# EAGLE design mcu_teensy3.6 (EAGLE 9.5.2)
c't-Bot v2 MCU Board; CC BY-SA 4.0, Timo Sandmann
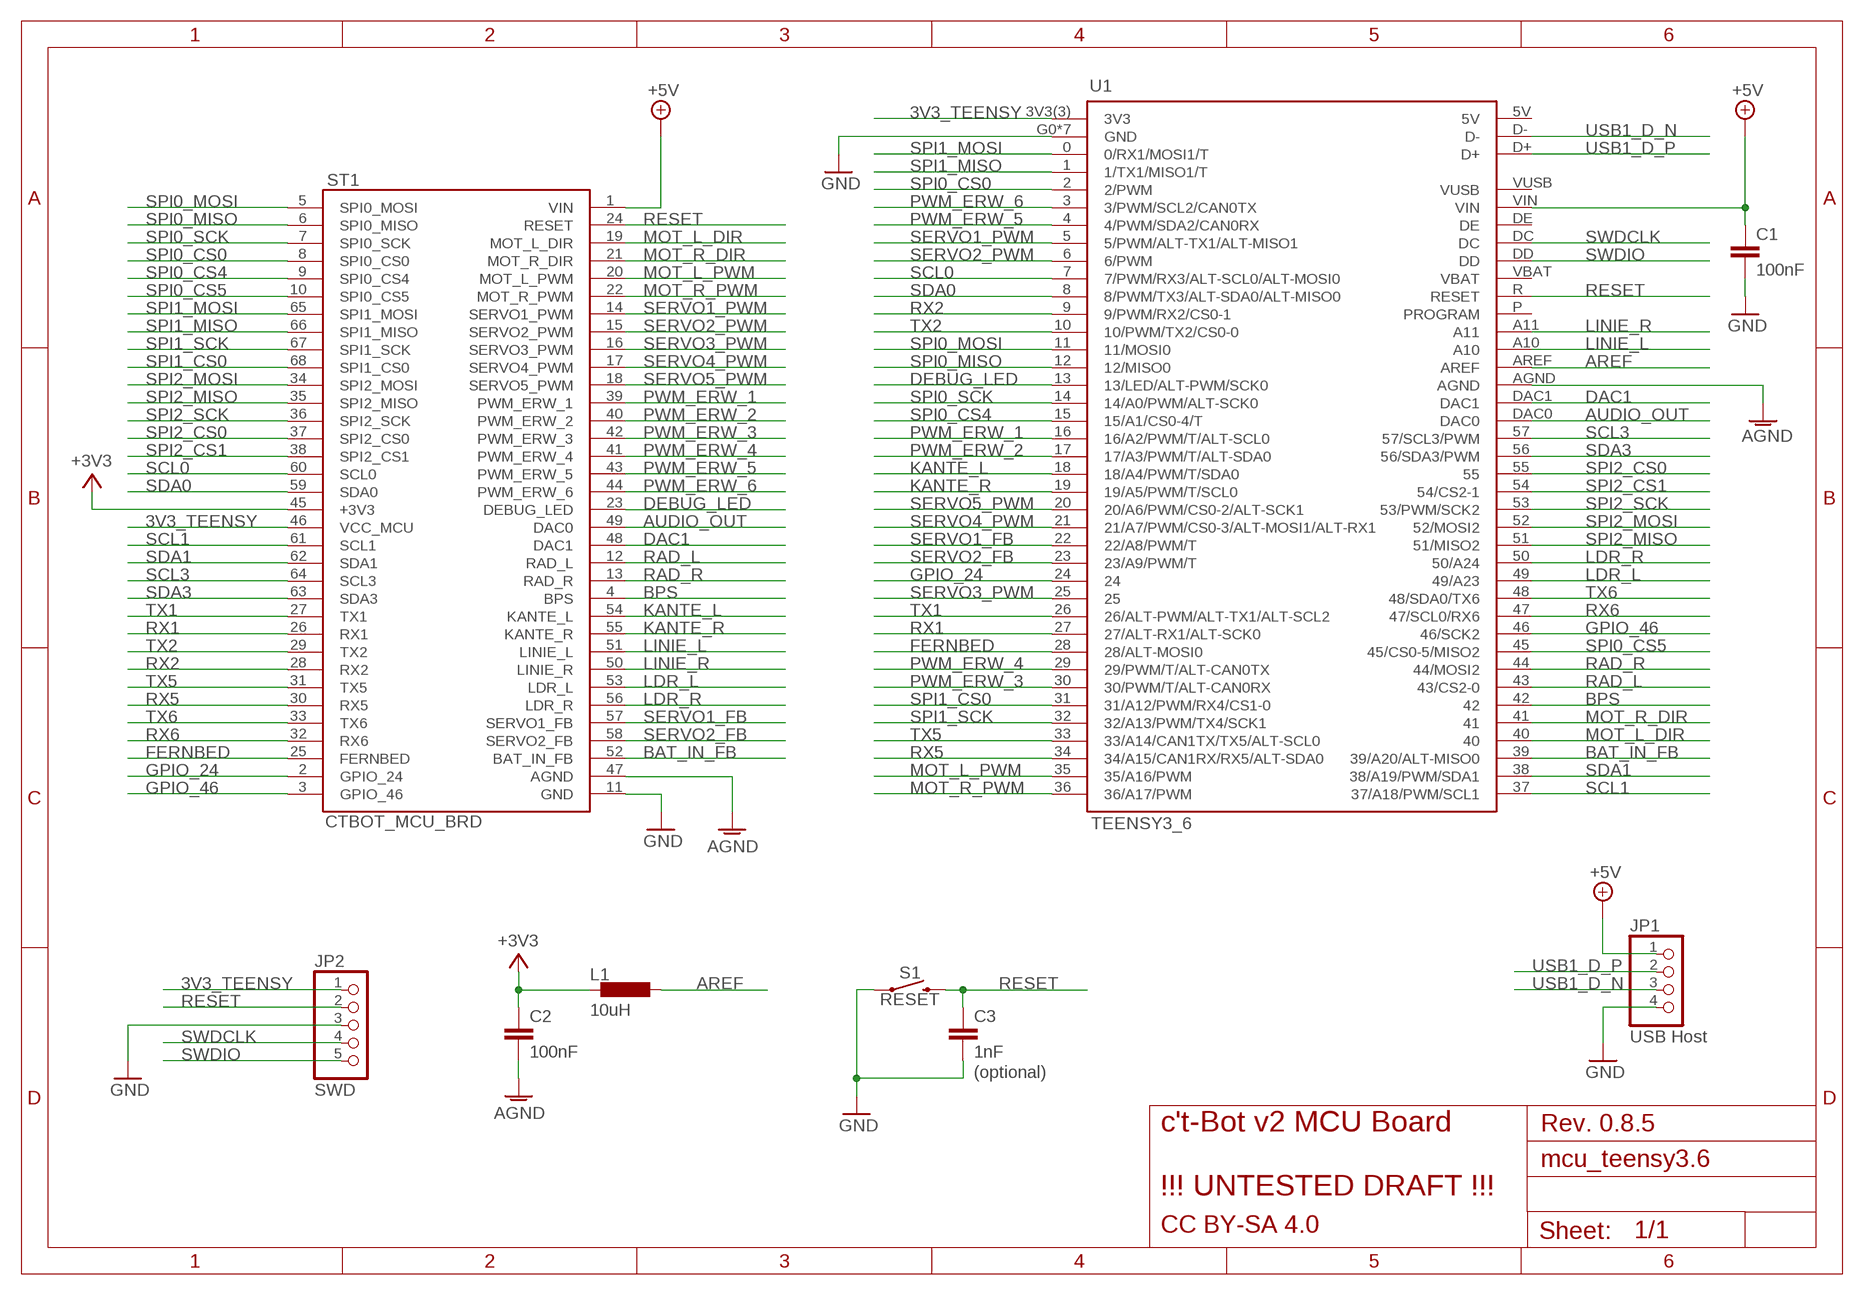
[diagram p0: schematic, sheet 1]

## Parts
C1  100nF  C-EU025-025X050  [C025-025X050]
C2  100nF  C-EU025-025X050  [C025-025X050]
C3  1nF  C-EU025-025X050  [C025-025X050]
JP1  USB Host  PINHD-1X4/90  [1X04/90]
JP2  SWD  PINHD-1X5/90  [1X05/90]
L1  10uH  L-EU0207/10  [0207/10]
S1  RESET  MOMENTARY-SWITCH-SPST-PTH-6.0MM  [TACTILE_SWITCH_PTH_6.0MM]
ST1  CTBOT_MCU_BRD  [DIP66]
U1  TEENSY3_6  [T36]

## Nets
3V3_TEENSY: JP2.1 ST1.46(VCC_MCU) U1.3V3(3)(3V3)
+3V3: C2.1 L1.2 ST1.45(+3V3)
+5V: C1.1 JP1.1 ST1.1(VIN) U1.VIN
AGND: C2.2 ST1.47(AGND) U1.AGND
AREF: L1.1 U1.AREF
AUDIO_OUT: ST1.49(DAC0) U1.DAC0
BAT_IN_FB: ST1.52(BAT_IN_FB) U1.39(39/A20/ALT-MISO0)
BPS: ST1.4(BPS) U1.42
DAC1: ST1.48(DAC1) U1.DAC1
DEBUG_LED: ST1.23(DEBUG_LED) U1.13(13/LED/ALT-PWM/SCK0)
FERNBED: ST1.25(FERNBED) U1.28(28/ALT-MOSI0)
GND: C1.2 C3.2 JP1.4 JP2.3 S1.1 ST1.11(GND) U1.G0(GND) U1.G1(GND) U1.G2(GND) U1.G3(GND) U1.G4(GND) U1.G5(GND) U1.G6(GND)
GPIO_24: ST1.2(GPIO_24) U1.24
GPIO_46: ST1.3(GPIO_46) U1.46(46/SCK2)
KANTE_L: ST1.54(KANTE_L) U1.18(18/A4/PWM/T/SDA0)
KANTE_R: ST1.55(KANTE_R) U1.19(19/A5/PWM/T/SCL0)
LDR_L: ST1.53(LDR_L) U1.49(49/A23)
LDR_R: ST1.56(LDR_R) U1.50(50/A24)
LINIE_L: ST1.51(LINIE_L) U1.A10
LINIE_R: ST1.50(LINIE_R) U1.A11
MOT_L_DIR: ST1.19(MOT_L_DIR) U1.40
MOT_L_PWM: ST1.20(MOT_L_PWM) U1.35(35/A16/PWM)
MOT_R_DIR: ST1.21(MOT_R_DIR) U1.41
MOT_R_PWM: ST1.22(MOT_R_PWM) U1.36(36/A17/PWM)
PWM_ERW_1: ST1.39(PWM_ERW_1) U1.16(16/A2/PWM/T/ALT-SCL0)
PWM_ERW_2: ST1.40(PWM_ERW_2) U1.17(17/A3/PWM/T/ALT-SDA0)
PWM_ERW_3: ST1.42(PWM_ERW_3) U1.30(30/PWM/T/ALT-CAN0RX)
PWM_ERW_4: ST1.41(PWM_ERW_4) U1.29(29/PWM/T/ALT-CAN0TX)
PWM_ERW_5: ST1.43(PWM_ERW_5) U1.4(4/PWM/SDA2/CAN0RX)
PWM_ERW_6: ST1.44(PWM_ERW_6) U1.3(3/PWM/SCL2/CAN0TX)
RAD_L: ST1.12(RAD_L) U1.43(43/CS2-0)
RAD_R: ST1.13(RAD_R) U1.44(44/MOSI2)
RESET: C3.1 JP2.2 S1.3 ST1.24(RESET) U1.R(RESET)
RX1: ST1.26(RX1) U1.27(27/ALT-RX1/ALT-SCK0)
RX2: ST1.28(RX2) U1.9(9/PWM/RX2/CS0-1)
RX5: ST1.30(RX5) U1.34(34/A15/CAN1RX/RX5/ALT-SDA0)
RX6: ST1.32(RX6) U1.47(47/SCL0/RX6)
SCL0: ST1.60(SCL0) U1.7(7/PWM/RX3/ALT-SCL0/ALT-MOSI0)
SCL1: ST1.61(SCL1) U1.37(37/A18/PWM/SCL1)
SCL3: ST1.64(SCL3) U1.57(57/SCL3/PWM)
SDA0: ST1.59(SDA0) U1.8(8/PWM/TX3/ALT-SDA0/ALT-MISO0)
SDA1: ST1.62(SDA1) U1.38(38/A19/PWM/SDA1)
SDA3: ST1.63(SDA3) U1.56(56/SDA3/PWM)
SERVO1_FB: ST1.57(SERVO1_FB) U1.22(22/A8/PWM/T)
SERVO1_PWM: ST1.14(SERVO1_PWM) U1.5(5/PWM/ALT-TX1/ALT-MISO1)
SERVO2_FB: ST1.58(SERVO2_FB) U1.23(23/A9/PWM/T)
SERVO2_PWM: ST1.15(SERVO2_PWM) U1.6(6/PWM)
SERVO3_PWM: ST1.16(SERVO3_PWM) U1.25
SERVO4_PWM: ST1.17(SERVO4_PWM) U1.21(21/A7/PWM/CS0-3/ALT-MOSI1/ALT-RX1)
SERVO5_PWM: ST1.18(SERVO5_PWM) U1.20(20/A6/PWM/CS0-2/ALT-SCK1)
SPI0_CS0: ST1.8(SPI0_CS0) U1.2(2/PWM)
SPI0_CS4: ST1.9(SPI0_CS4) U1.15(15/A1/CS0-4/T)
SPI0_CS5: ST1.10(SPI0_CS5) U1.45(45/CS0-5/MISO2)
SPI0_MISO: ST1.6(SPI0_MISO) U1.12(12/MISO0)
SPI0_MOSI: ST1.5(SPI0_MOSI) U1.11(11/MOSI0)
SPI0_SCK: ST1.7(SPI0_SCK) U1.14(14/A0/PWM/ALT-SCK0)
SPI1_CS0: ST1.68(SPI1_CS0) U1.31(31/A12/PWM/RX4/CS1-0)
SPI1_MISO: ST1.66(SPI1_MISO) U1.1(1/TX1/MISO1/T)
SPI1_MOSI: ST1.65(SPI1_MOSI) U1.0(0/RX1/MOSI1/T)
SPI1_SCK: ST1.67(SPI1_SCK) U1.32(32/A13/PWM/TX4/SCK1)
SPI2_CS0: ST1.37(SPI2_CS0) U1.55
SPI2_CS1: ST1.38(SPI2_CS1) U1.54(54/CS2-1)
SPI2_MISO: ST1.35(SPI2_MISO) U1.51(51/MISO2)
SPI2_MOSI: ST1.34(SPI2_MOSI) U1.52(52/MOSI2)
SPI2_SCK: ST1.36(SPI2_SCK) U1.53(53/PWM/SCK2)
SWDCLK: JP2.4 U1.DC
SWDIO: JP2.5 U1.DD
TX1: ST1.27(TX1) U1.26(26/ALT-PWM/ALT-TX1/ALT-SCL2)
TX2: ST1.29(TX2) U1.10(10/PWM/TX2/CS0-0)
TX5: ST1.31(TX5) U1.33(33/A14/CAN1TX/TX5/ALT-SCL0)
TX6: ST1.33(TX6) U1.48(48/SDA0/TX6)
USB1_D_N: JP1.3 U1.D-
USB1_D_P: JP1.2 U1.D+
Unconnected: U1.5V U1.DE U1.P(PROGRAM) U1.VBAT U1.VUSB

## Notes on the sheet
- (optional)
- Rev. 0.8.5
- c't-Bot v2 MCU Board
  
  !!! UNTESTED DRAFT !!!
- CC BY-SA 4.0

## Library data of the parts
C1-C3 = rcl:C-EU: CAPACITOR, European symbol; SPICEPREFIX: C
JP1 = pinhead_ts:PINHD-1X4: PIN HEADER
JP2 = pinhead_ts:PINHD-1X5: PIN HEADER
L1 = rcl:L-EU: INDUCTOR, European symbol; SPICEPREFIX: L
S1 = SparkFun-Switches:MOMENTARY-SWITCH-SPST: Momentary Switch (Pushbutton) - SPST Normally-open (NO) SPST momentary switches (buttons, pushbuttons). Variants PTH-12MM - 12mm square, through-hole Momentary Pushbutton Switch - 12mm Square <https://www.sparkfun.com/products/9190> (COM-09190) PTH-6.0MM, PTH-6.0MM-KIT - 6.0mm square, through-hole Mini Pushbutton Switch <https://www.sparkfun.com/products/97> (COM-00097) KIT package intended for soldering kit's - only one side of pads' copper is exposed. PTH-RIGHT-ANGLE-KIT - Right-angle, through-hole Right Angle Tactile Button <https://www.sparkfun.com/products/10791> - Used on SparkFun BigTime Watch Kit <https://www.sparkfun.com/products/11734> SMD-12MM - 12mm square, surface-mount Tactile Button - SMD (12mm) <https://www.sparkfun.com/products/12993> (COM-12993) Used on SparkFun PicoBoard <https://www.sparkfun.com/products/11888> SMD-4.5MM - 4.5mm Square Trackball Switch Used on SparkFun Blackberry Trackballer Breakout <https://www.sparkfun.com/products/13169> SMD-4.6MMX2.8MM - 4.60mm x 2.80mm, surface mount Used on SparkFun SAMD21 Mini Breakout <https://www.sparkfun.com/products/13664> SMD-5.2MM, SMD-5.2-REDUNDANT - 5.2mm square, surface-mount Mini Pushbutton Switch - SMD <https://www.sparkfun.com/products/8720> (COM-08720) Used on Arduino Pro Mini <https://www.sparkfun.com/products/11114> REDUNDANT package connects both switch circuits together SMD-6.0X3.5MM - 6.0 x 3.5mm, surface mount Momentary Reset Switch SMD <https://www.sparkfun.com/products/8229> (COM-08229) SMD-6.2MM-TALL - 6.2mm square, surface mount Tactile Button - SMD (6mm) <https://www.sparkfun.com/products/12992> Used on SparkFun Digital Sandbox <https://www.sparkfun.com/products/12651> SMD-RIGHT-ANGLE - Right-angle, surface mount Used on SparkFun Block for Intel® Edison - Arduino <https://www.sparkfun.com/products/13036>; PROD_ID: SWCH-08441; SF_SKU: COM-00097
ST1 = ct-bot:CTBOT_MCU_BRD
U1 = ct-bot:TEENSY3_6

## Board
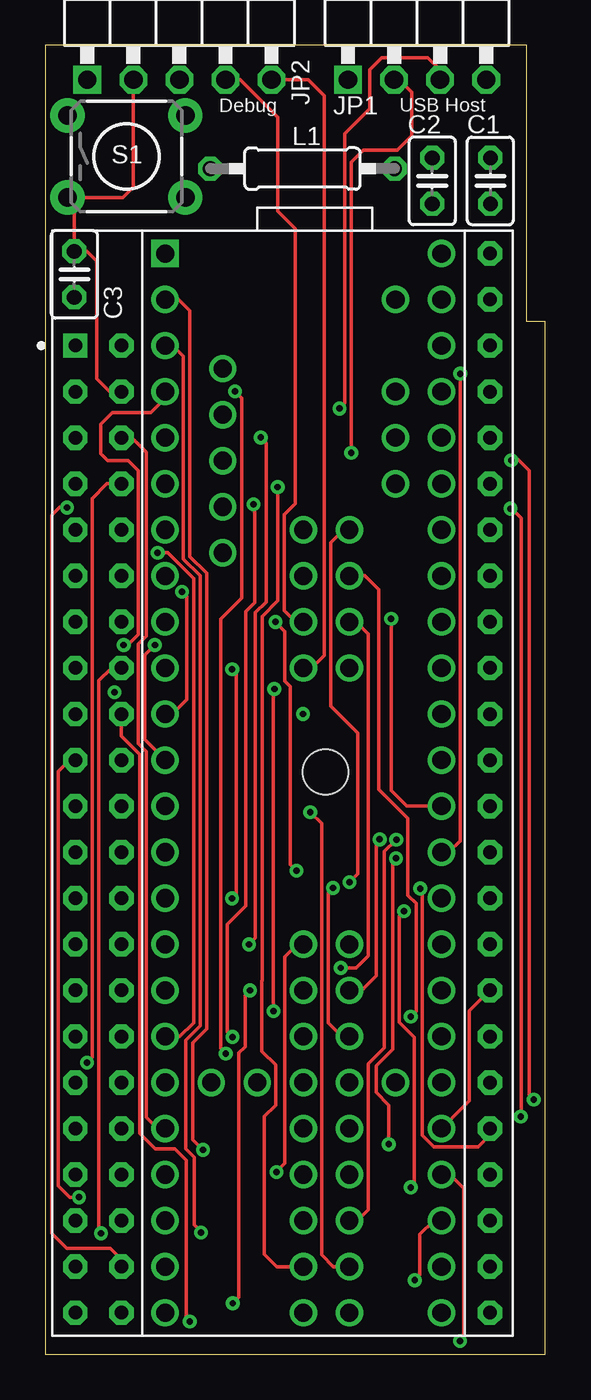
[diagram p1: board, top side]
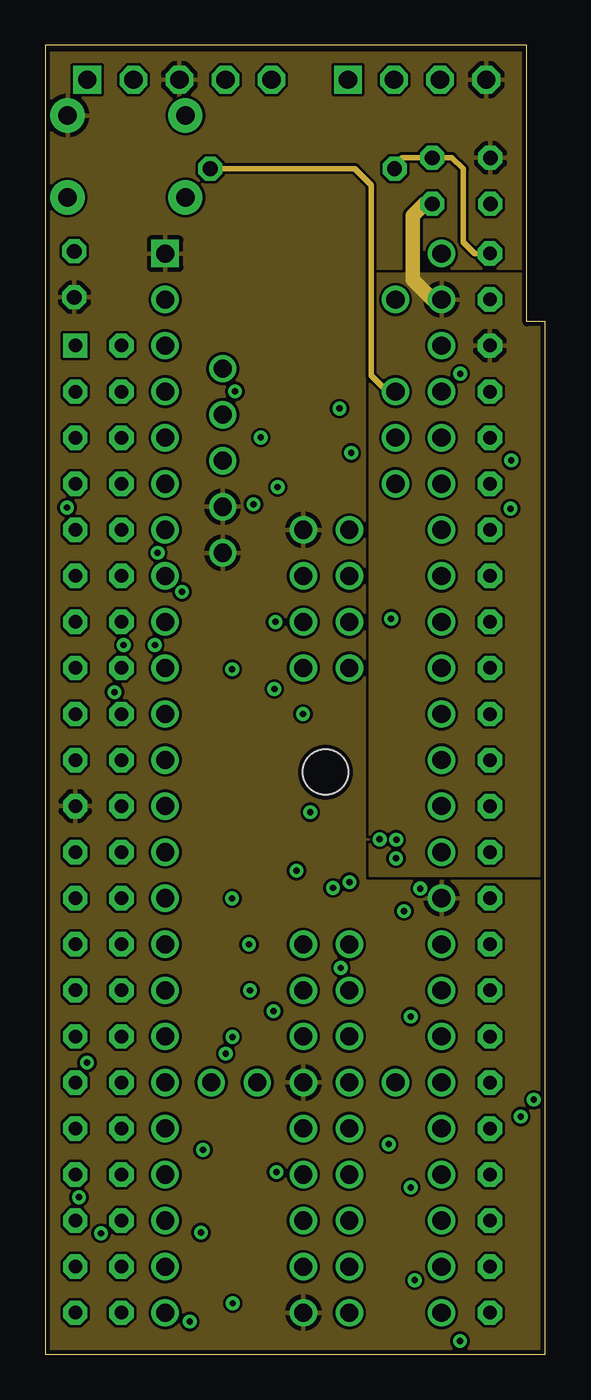
[diagram p2: board, inner layer GND]
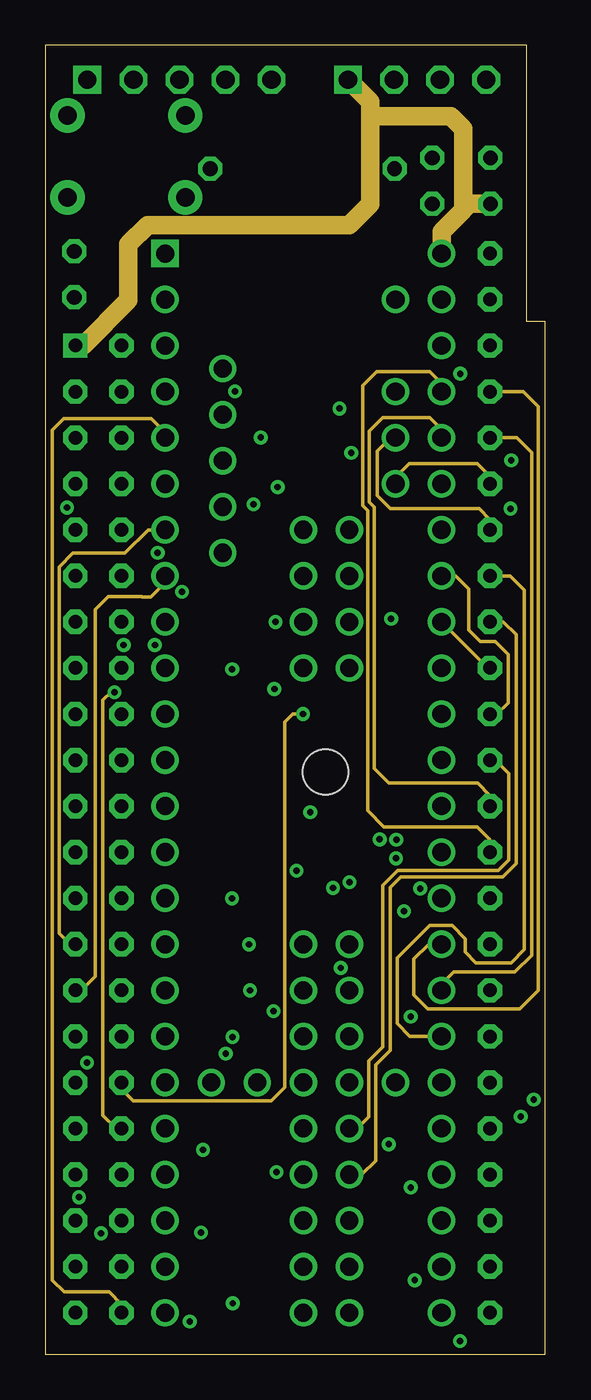
[diagram p3: board, inner layer ANALOG]
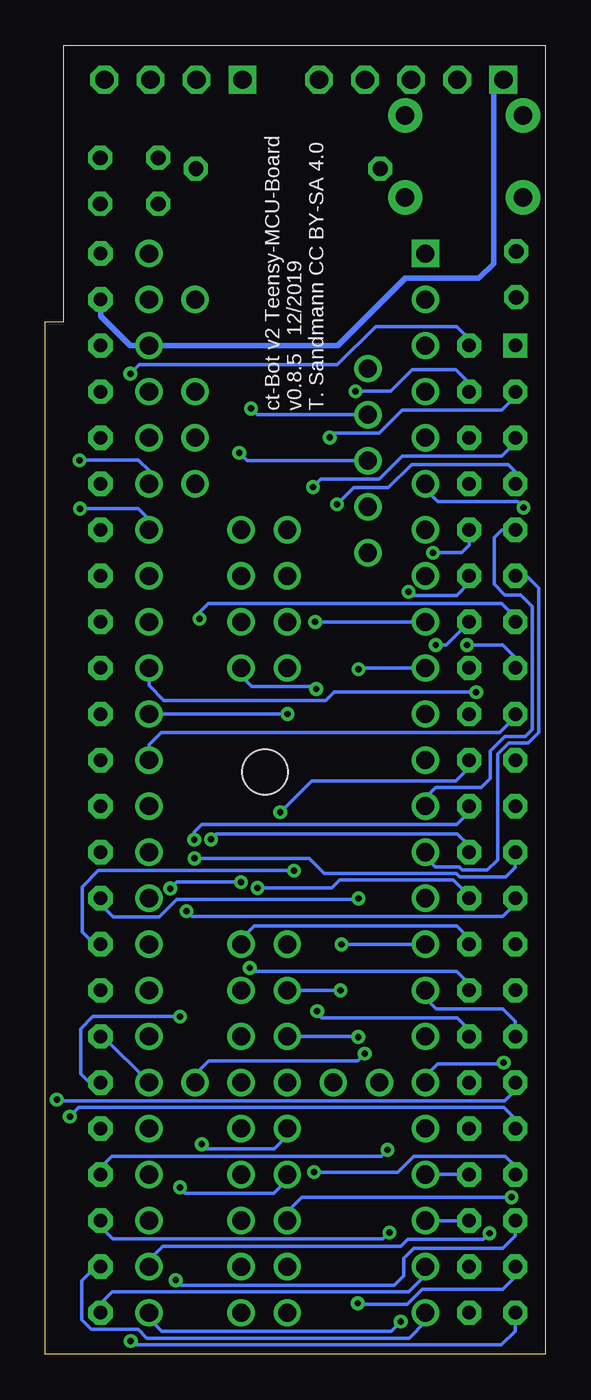
[diagram p4: board, bottom side, seen from below]

Size 27.56 x 72.19 mm. Coordinates in mm from the lower left corner, seen from the top.
Outline: 0,0 27.56,0 27.56,56.95 26.54,56.95 26.54,72.19 0,72.19 0,0
Copper layers (1+2*15+16): Top 0.035mm / dielectric 0.2mm / GND 0.0175mm / dielectric 1.065mm / ANALOG 0.0175mm / dielectric 0.2mm / Bottom 0.035mm
Design rules "jlcpcb_4layer_DRU": minimum track width 6mil, minimum drill 0.3mm, track to track 6mil, track to pad 6mil, pad to pad 6mil, via to via 6mil, smd to smd 6mil, copper to edge 10mil, drill to drill 6mil, minimum pad ring 10mil, minimum via ring 8mil, stop-mask expansion 4mil, vias tented up to drill 0mil, thermal gap 10mil
Holes 2.5 mm at 15.45,32.11

### Footprints (pad centres in the part's own frame; a part is rotated, then mirrored left to right if it is on the bottom)
C025-025X050 = drill 0.813 octagon: 1 -1.27,0; 2 1.27,0
1X04/90 = drill 1.016 square: 1 -3.81,-3.81 | drill 1.016 octagon: 2 -1.27,-3.81; 3 1.27,-3.81; 4 3.81,-3.81
1X05/90 = drill 1.016 square: 1 -5.08,-3.81 | drill 1.016 octagon: 2 -2.54,-3.81; 3 0,-3.81; 4 2.54,-3.81; 5 5.08,-3.81
0207/10 = drill 0.813 octagon: 1 -5.08,0; 2 5.08,0
TACTILE_SWITCH_PTH_6.0MM = drill 1.016 pad 1.88: 1 -3.251,2.261; 2 3.251,2.261; 3 -3.251,-2.261; 4 3.251,-2.261
DIP66 = drill 0.743 pad 1.343 square: 1 -11.43,25.4 | drill 0.743 pad 1.343 octagon: 2 -11.43,22.86; 3 -11.43,20.32; 4 -11.43,17.78; 5 -11.43,15.24; 6 -11.43,12.7; 7 -11.43,10.16; 8 -11.43,7.62; 9 -11.43,5.08; 10 -11.43,2.54; 11 -11.43,0; 12 -11.43,-2.54; 13 -11.43,-5.08; 14 -11.43,-7.62; 15 -11.43,-10.16; 16 -11.43,-12.7; 17 -11.43,-15.24; 18 -11.43,-17.78; 19 -11.43,-20.32; 20 -11.43,-22.86; 21 -11.43,-25.4; 22 -11.43,-27.94; 23 -8.89,25.4; 24 -8.89,22.86; 25 -8.89,20.32; 26 -8.89,17.78; 27 -8.89,15.24; 28 -8.89,12.7; 29 -8.89,10.16; 30 -8.89,7.62; 31 -8.89,5.08; 32 -8.89,2.54; 33 -8.89,0; 34 -8.89,-2.54; 35 -8.89,-5.08; 36 -8.89,-7.62; 37 -8.89,-10.16; 38 -8.89,-12.7; 39 -8.89,-15.24; 40 -8.89,-17.78; 41 -8.89,-20.32; 42 -8.89,-22.86; 43 -8.89,-25.4; 44 -8.89,-27.94; 45 11.43,30.48; 46 11.43,27.94; 47 11.43,25.4; 48 11.43,22.86; 49 11.43,20.32; 50 11.43,17.78; 51 11.43,15.24; 52 11.43,12.7; 53 11.43,10.16; 54 11.43,7.62; 55 11.43,5.08; 56 11.43,2.54; 57 11.43,0; 58 11.43,-2.54; 59 11.43,-5.08; 60 11.43,-7.62; 61 11.43,-10.16; 62 11.43,-12.7; 63 11.43,-15.24; 64 11.43,-17.78; 65 11.43,-20.32; 66 11.43,-22.86; 67 11.43,-25.4; 68 11.43,-27.94
T36 = drill 1: 0 -26.67,-7.62; 1 -24.13,-7.62; 2 -21.59,-7.62; 3 -19.05,-7.62; 3V3(1) 6.35,-7.62; 3V3(2) 16.51,-2.54; 3V3(3) -24.13,7.62; 3V3(4) 29.21,2.54; 4 -16.51,-7.62; 5 -13.97,-7.62; 5V -22.86,-4.445; 6 -11.43,-7.62; 7 -8.89,-7.62; 8 -6.35,-7.62; 9 -3.81,-7.62; 10 -1.27,-7.62; 11 1.27,-7.62; 12 3.81,-7.62; 13 3.81,7.62; 14 1.27,7.62; 15 -1.27,7.62; 16 -3.81,7.62; 17 -6.35,7.62; 18 -8.89,7.62; 19 -11.43,7.62; 20 -13.97,7.62; 21 -16.51,7.62; 22 -19.05,7.62; 23 -21.59,7.62; 24 8.89,-7.62; 25 11.43,-7.62; 26 13.97,-7.62; 27 16.51,-7.62; 28 19.05,-7.62; 29 21.59,-7.62; 30 24.13,-7.62; 31 26.67,-7.62; 32 29.21,-7.62; 33 29.21,7.62; 34 26.67,7.62; 35 24.13,7.62; 36 21.59,7.62; 37 19.05,7.62; 38 16.51,7.62; 39 13.97,7.62; 40 8.89,0; 41 11.43,0; 42 13.97,0; 43 19.05,0; 44 21.59,0; 45 24.13,0; 46 26.67,0; 47 26.67,2.54; 48 24.13,2.54; 49 21.59,2.54; 50 19.05,2.54; 51 13.97,2.54; 52 11.43,2.54; 53 8.89,2.54; 54 -6.35,2.54; 55 -8.89,2.54; 56 -11.43,2.54; 57 -13.97,2.54; A10 -19.05,5.08; A11 -16.51,5.08; AGND -26.67,7.62; AREF -21.59,5.08; D+ -17.78,-4.445; D- -20.32,-4.445; DAC0 11.43,7.62; DAC1 8.89,7.62; DC -8.89,0; DD -6.35,0; DE -11.43,0; G1 16.51,0; G2 6.35,7.62; G3 29.21,0; G4 -15.24,-4.445; G5 -12.7,-4.445; G6 -13.97,0; P 16.51,2.54; R 16.51,5.08; VBAT 16.51,-5.08; VIN -29.21,7.62; VUSB -26.67,5.08 | drill 1 square: G0 -29.21,-7.62

### Placement (x,y rotation side)
C1  24.54,64.71 90 top
C2  21.33,64.71 270 top
C3  1.6,59.56 270 top
JP1  20.5,74.1 0 top
JP2  7.39,74.1 0 top
L1  14.17,65.39 0 top
S1  4.47,66.06 0 top
ST1  13.08,30.23 0 top
U1  14.22,31.5 270 top

### Tracks (layer width: path | path; a pad name or v marks a point on that pad's centre or on a via)
3V3_TEENSY
  Bottom 0.305: ST1.46 24.51,57.26 22.88,55.63 U1.3V3(3) 11.43,55.63 7.72,59.34 3.66,59.34 2.85,60.15 2.85,69.75 JP2.1
+3V3
  GND 0.305: L1.2 19.25,65.58 19.67,65.99 21.32,65.99 C2.1 21.35,66 22.42,66 23.05,65.37 23.05,61.33 23.68,60.71 ST1.45
+5V
  ANALOG 1.016: 17.91,68.28 17.91,63.43 16.75,62.28 5.64,62.28 4.57,61.21 4.57,58.12 2.08,55.63 ST1.1 | 17.91,68.28 17.91,69.07 JP1.1 | U1.VIN 21.84,61.9 23.04,63.1 | C1.1 23.38,63.44 23.04,63.1 | 17.91,68.28 22.35,68.28 23.04,67.59 23.04,63.1
AGND
  GND 0.813: U1.AGND 21.37,58.17 20.27,59.27 20.27,62.79 20.92,63.44 C2.2
  pour GND (rank 2): 17.91,59.56 28.14,59.56 28.14,26.42 17.91,26.42
AREF
  GND 0.305: U1.AREF 18.84,53.09 17.97,53.96 17.97,64.48 17.06,65.39 L1.1
AUDIO_OUT
  ANALOG 0.203: ST1.49 25.99,50.55 26.8,49.73 26.8,21.99 25.89,21.08 22.53,21.08 21.84,20.4 U1.DAC0
BAT_IN_FB
  ANALOG 0.203: ST1.52 25.63,42.93 26.41,42.15 26.41,22.32 25.69,21.59 23.74,21.59 23.15,22.18 23.15,22.91 22.42,23.64 21.18,23.64 19.39,21.85 19.39,18.23 20.1,17.53 U1.39
BPS  (via drill 0.35)
  Top 0.203: v10.31,17.49 10.04,17.77 10.04,23.7 11.05,24.71 11.05,40.95 11.55,41.45 11.55,46.8 v11.48,46.87
  Bottom 0.203: U1.42 10.34,17.53 v10.31,17.49 | ST1.4 1.64,48.02 1.64,48.67 2.05,49.07 7.36,49.07 8.65,47.78 10.57,47.78 v11.48,46.87
DAC1
  ANALOG 0.203: ST1.48 26.36,53.09 27.18,52.26 27.18,20.06 26.16,19.05 21.09,19.05 20.32,19.82 20.32,21.8 21.13,22.61 U1.DAC1
DEBUG_LED  (via drill 0.35)
  Top 0.203: U1.13 22.25,27.69 22.87,28.31 v22.87,54.08
  Bottom 0.203: v22.87,54.08 22.38,54.57 11.47,54.57 9.35,56.69 4.88,56.69 4.19,55.99 ST1.23
FERNBED
  Top 0.203: ST1.25 4.76,50.55 5.56,49.75 5.56,39.6 5.12,39.17 5.12,33.67 5.56,33.23 5.56,13.06 6.18,12.45 U1.28
GND
  pour GND (rank 6): -0.89,71.75 28.5,71.75 28.5,-0.51 -0.89,-0.51
GPIO_24  (via drill 0.35)
  Top 0.203: v11.23,22.6 11.58,22.95 11.58,40.91 12.17,41.49 12.17,50.26 v11.88,50.56
  Bottom 0.203: ST1.2 1.65,52.81 2.39,52.07 7.87,52.07 9.14,50.8 11.63,50.8 v11.88,50.56 | v11.23,22.6 U1.24
GPIO_46  (via drill 0.35)
  Top 0.203: v12.81,47.83 12.81,41.55 11.95,40.69 11.95,20.59 11.94,20.58 11.94,16.71 12.7,15.95 12.7,13.73 12.07,13.11 12.07,5.52 12.76,4.83 U1.46 | U1.46
  Bottom 0.203: ST1.3 1.65,50.27 2.39,49.53 7.87,49.53 9.14,48.26 12.37,48.26 v12.81,47.83
KANTE_L
  ANALOG 0.203: U1.18 24.38,37.85 ST1.54
KANTE_R
  ANALOG 0.203: ST1.55 24.9,35.31 25.51,35.92 25.51,38.58 24.8,39.3 23.98,39.3 23.34,39.94 23.34,42.21 22.62,42.93 U1.19
LDR_L
  ANALOG 0.203: U1.49 17.45,9.91 18.22,10.67 18.22,11.39 18.22,11.38 18.22,15.96 19.01,16.75 19.01,25.73 19.59,26.31 25.21,26.31 25.95,27.06 25.95,39.68 25.25,40.39 ST1.53
LDR_R
  ANALOG 0.203: ST1.56 24.81,32.77 25.54,32.03 25.54,27.26 24.96,26.68 24.67,26.68 24.66,26.68 19.42,26.68 18.6,25.86 18.6,16.95 17.83,16.19 17.83,13.09 17.19,12.45 U1.50
LINIE_L
  ANALOG 0.203: U1.A10 19.03,50.55 18.3,49.81 18.3,47.34 19,46.64 23.91,46.64 24.51,46.04 ST1.51
LINIE_R
  ANALOG 0.203: U1.A11 19.3,48.36 20.07,49.12 23.82,49.12 24.51,48.43 ST1.50
MOT_L_DIR  (via drill 0.35)
  Top 0.203: v12.75,10.04 12.75,10.06 13.21,10.52 13.21,21.9 13.91,22.61 U1.40
  Bottom 0.203: ST1.19 1.65,10.38 2.19,10.92 7.26,10.92 8.14,10.04 v12.74,10.04 v12.75,10.04
MOT_L_PWM  (via drill 0.35)
  Top 0.203: U1.35 21.42,7.37 20.66,6.6 20.66,4.37 v20.37,4.08
  Bottom 0.203: v20.37,4.08 20.09,3.8 8.33,3.8 7.8,4.33 7.8,5.27 7.24,5.83 6.97,5.83 6.96,5.85 2.34,5.85 1.65,6.54 ST1.20 | ST1.20
MOT_R_DIR  (via drill 0.35)
  Top 0.203: v11.29,20.06 11.01,19.79 11.01,16.96 10.67,16.62 10.67,3.14 v10.33,2.81
  Bottom 0.203: v11.29,20.06 U1.41 | v10.33,2.81 10.29,2.76 7.62,2.76 6.79,3.59 2.33,3.59 1.65,4.27 ST1.21
MOT_R_PWM  (via drill 0.35)
  Top 0.203: v22.86,0.73 23.08,0.95 23.08,9.13 22.3,9.91 U1.36
  Bottom 0.203: ST1.22 1.65,1.27 2.42,0.51 22.64,0.51 v22.86,0.73
PWM_ERW_1  (via drill 0.35)
  ANALOG 0.203: v14.21,35.31 13.65,35.31 13.21,34.86 13.21,14.72 12.46,13.98 4.84,13.98 4.19,14.63 ST1.39
  Bottom 0.203: U1.16 v14.21,35.31
PWM_ERW_2  (via drill 0.35)
  ANALOG 0.203: ST1.40 3.9,12.45 3.17,13.17 3.17,36.07 3.62,36.51 v3.81,36.51
  Bottom 0.203: v3.81,36.51 11.63,36.51 12.09,36.06 21.03,36.06 21.84,36.87 U1.17
PWM_ERW_3
  Bottom 0.203: ST1.42 U1.30
PWM_ERW_4
  Bottom 0.203: U1.29 ST1.41
PWM_ERW_5  (via drill 0.35)
  Top 0.203: ST1.43 4.19,5.23 3.57,5.85 1.18,5.85 0.36,6.67 0.36,46.29 0.8,46.73 1.15,46.73 v1.19,46.7
  Bottom 0.203: v1.19,46.7 1.51,47.02 5.93,47.02 6.6,47.69 U1.4
PWM_ERW_6
  ANALOG 0.203: ST1.44 4.19,2.76 3.53,3.43 1.04,3.43 0.38,4.09 0.38,50.96 1.02,51.59 5.84,51.59 6.6,50.83 U1.3
RAD_L  (via drill 0.35)
  Top 0.203: v18.94,11.58 18.94,13.73 18.23,14.44 18.23,15.89 19.14,16.8 19.14,27.15 v19.34,27.35
  Bottom 0.203: v18.94,11.58 18.7,11.34 14.94,11.34 14.22,12.06 U1.43 | v19.34,27.35 13.02,27.35 12.19,26.52 4.91,26.52 4.7,26.31 2.18,26.31 1.65,26.84 ST1.12
RAD_R  (via drill 0.35)
  Top 0.203: v20.14,9.2 20.34,9.4 20.34,17.46 19.51,18.3 19.51,24.17 v19.78,24.44
  Bottom 0.203: ST1.13 1.65,24.83 2.35,24.13 19.47,24.13 v19.78,24.44 | U1.44 14.22,9.61 14.97,8.86 19.86,8.86 20.14,9.15 v20.14,9.2
RESET  (via drill 0.35)
  Top 0.203: v9.95,16.58 9.66,16.87 9.66,40.54 10.84,41.71 10.84,52.73 v10.46,53.1 | ST1.24 3.56,53.09 2.84,53.8 2.84,60.28 2.29,60.83 C3.1 1.6,63.42 S1.3 4.27,63.8 4.85,64.37 JP2.2
  Bottom 0.203: U1.R 19.3,15.43 18.55,16.19 10.34,16.19 v9.95,16.58 | v10.46,53.1 8.52,53.1 7.33,54.29 4.93,54.29 4.17,53.54 4.17,53.1 ST1.24
RX1  (via drill 0.35)
  Top 0.203: ST1.26 3.4,48.01 2.58,47.19 2.58,16.38 v2.29,16.09
  Bottom 0.203: v2.29,16.09 2.38,16 5.93,16 6.6,15.33 U1.27
RX2  (via drill 0.35)
  Top 0.203: U1.9 7.01,35.31 7.8,36.1 7.8,41.78 v7.54,42.04
  Bottom 0.203: v7.54,42.04 7.35,41.85 4.88,41.85 4.19,42.55 ST1.28
RX5  (via drill 0.35)
  Top 0.203: v3.06,6.67 2.94,6.79 2.94,37.14 3.65,37.85 ST1.30
  Bottom 0.203: U1.34 21.84,5.19 21.09,5.94 7.97,5.94 7.59,6.33 3.41,6.33 v3.06,6.67
RX6  (via drill 0.35)
  Top 0.203: U1.47 15.87,4.83 15.23,5.47 15.23,29.26 v14.61,29.89
  Bottom 0.203: ST1.32 4.19,32.36 4.93,31.62 12.86,31.62 v14.6,29.89 v14.61,29.89
SCL0  (via drill 0.35)
  Top 0.203: v12.68,40.39 13.21,39.86 13.21,37.12 13.51,36.82 13.51,27 v13.84,26.67
  Bottom 0.203: v12.68,40.39 U1.7 | ST1.60 24.84,22.61 25.53,23.29 25.53,25.78 24.64,26.67 v13.84,26.67
SCL1
  Top 0.203: U1.37 23.38,13.98 23.38,18.93 ST1.61
SCL3  (via drill 0.35)
  Top 0.203: U1.57 16.43,45.47 15.73,44.76 15.73,35.74 17.21,34.26 17.21,26.47 v16.77,26.03 | ST1.64 24.51,12.09 23.86,11.44 21.43,11.44 20.79,12.07 20.79,25.56 v20.67,25.68
  Bottom 0.203: v20.67,25.68 20.32,26.03 v16.77,26.03
SDA0  (via drill 0.35)
  Top 0.203: v10.3,25.13 10.52,25.35 10.52,37.55 v10.3,37.77
  Bottom 0.203: U1.8 | v10.3,37.77 10.23,37.85 U1.8 | v10.3,25.13 10.35,25.08 20.31,25.08 21.27,24.12 23.82,24.12 24.51,24.81 ST1.59
SDA1
  Bottom 0.203: U1.38 24.38,17.53 ST1.62
SDA3  (via drill 0.35)
  Top 0.203: U1.56 17.61,42.93 18.38,42.17 18.38,31.16 19.99,29.55 19.99,25.3 20.44,24.85 20.44,18.91 v20.14,18.62
  Bottom 0.203: v20.14,18.62 24.95,18.62 25.62,17.94 25.62,15.47 25.1,14.95 24.54,14.95 ST1.63
SERVO1_FB
  ANALOG 0.203: ST1.57 24.51,30.82 23.83,31.5 18.94,31.5 18.13,32.31 18.13,46.73 17.85,47 17.85,50.91 18.6,51.65 21.2,51.65 21.88,50.97 21.88,50.58 U1.22
SERVO1_PWM
  ANALOG 0.203: U1.5 5.66,45.47 4.38,44.18 1.52,44.18 0.77,43.42 0.77,23.21 1.37,22.61 ST1.14
SERVO2_FB
  ANALOG 0.203: ST1.58 24.51,28.39 23.81,29.08 18.67,29.08 17.77,29.98 17.77,46.52 17.5,46.8 17.5,53.42 18.27,54.19 21.19,54.19 21.84,53.53 U1.23
SERVO2_PWM
  ANALOG 0.203: ST1.15 1.98,20.07 2.74,20.82 2.74,41.06 3.46,41.78 5.32,41.78 5.34,41.76 5.81,41.76 6.6,42.56 U1.6
SERVO3_PWM
  Bottom 0.203: ST1.16 1.65,18.35 2.35,19.05 5.99,19.05 6.6,19.66 U1.25
SERVO4_PWM  (via drill 0.35)
  Top 0.203: v26.93,14.03 26.67,14.29 26.67,48.72 26.06,49.33 25.71,49.33 v25.68,49.3
  Bottom 0.203: ST1.17 1.65,14.54 2.22,13.97 26.86,13.97 v26.93,14.03 | v25.68,49.3 22.42,49.3 21.84,48.72 U1.21
SERVO5_PWM  (via drill 0.35)
  Top 0.203: v26.21,13.1 26.25,13.15 26.25,46.1 25.72,46.63 v25.65,46.63
  Bottom 0.203: ST1.18 1.65,12.98 2.28,13.61 25.72,13.61 26.21,13.12 v26.21,13.1 | v25.65,46.63 22.43,46.63 21.83,46.03 21.83,45.48 U1.20
SPI0_CS0  (via drill 0.35)
  Top 0.203: v4.32,39.12 4.53,39.12 5.12,39.7 5.12,48.73 4.57,49.28 3.43,49.28 3.05,49.66 3.05,51.31 3.68,51.94 5.81,51.94 6.6,52.74 U1.2
  Bottom 0.203: ST1.8 1.65,38.42 2.35,39.12 v4.32,39.12
SPI0_CS4
  Bottom 0.203: ST1.9 1.65,35.15 2.51,34.29 21.17,34.29 21.84,33.62 U1.15
SPI0_CS5  (via drill 0.35)
  Top 0.203: ST1.10 1.35,32.77 0.72,32.14 0.72,9.28 1.35,8.65 v1.84,8.65 v1.85,8.66
  Bottom 0.203: v1.85,8.66 13.43,8.66 14.22,7.86 U1.45
SPI0_MISO
  Bottom 0.203: U1.12 6.6,27.43 6.05,26.87 4.74,26.87 4.57,26.7 3.19,26.7 2.62,27.27 2.62,33.11 2.02,33.71 0.94,33.71 0.36,34.29 0.36,42.25 1.03,42.93 ST1.6
SPI0_MOSI
  Bottom 0.203: U1.11 6.6,30.68 6.03,31.25 3.53,31.25 3.02,31.75 3.02,33.27 2.23,34.06 1.1,34.06 0.71,34.46 0.71,41.24 1.36,41.88 2.24,41.88 2.82,42.46 2.82,45.05 2.4,45.47 ST1.5
SPI0_SCK  (via drill 0.35)
  Top 0.203: v19.06,40.56 19.06,31.09 19.93,30.23 U1.14
  Bottom 0.203: ST1.7 1.65,40.66 2.39,41.4 18.57,41.4 19.06,40.91 v19.06,40.56
SPI1_CS0
  Bottom 0.203: ST1.68 24.51,2.79 23.86,3.44 7.51,3.44 6.6,4.35 U1.31
SPI1_MISO  (via drill 0.35)
  Top 0.203: v8.59,6.71 8.59,6.73 8.2,7.12 8.2,10.86 7.74,11.32 7.74,17.31 8.53,18.1 8.53,42.94 7.61,43.85 7.61,55.05 7.04,55.63 U1.1
  Bottom 0.203: ST1.66 24.51,7.03 23.83,6.35 8.95,6.35 v8.59,6.71
SPI1_MOSI  (via drill 0.35)
  Top 0.203: U1.0 6.61,58.18 7.34,58.18 7.97,57.54 7.97,44 8.9,43.07 8.9,17.94 8.13,17.17 8.13,11.83 v8.69,11.27
  Bottom 0.203: ST1.65 24.51,10.31 23.9,10.92 9.04,10.92 v8.69,11.27
SPI1_SCK
  Bottom 0.203: U1.32 6.6,1.78 7.49,0.89 21.97,0.89 22.44,1.36 25.03,1.36 25.56,1.89 25.56,4.05 24.79,4.83 ST1.67
SPI2_CS0  (via drill 0.35)
  Top 0.203: U1.55 17.13,40.39 17.8,39.72 17.8,21.97 17.13,21.3 v16.3,21.3 v16.29,21.3
  Bottom 0.203: ST1.37 4.19,20.42 4.88,21.1 16.09,21.1 v16.29,21.3
SPI2_CS1  (via drill 0.35)
  Top 0.203: v12.63,36.69 | v12.63,36.69 12.57,36.64 12.57,19.17 | 12.57,19.17 | 12.57,19.17 v12.57,18.92
  Bottom 0.203: ST1.38 4.19,17.88 4.86,18.54 12.32,18.54 12.57,18.8 v12.57,18.92 | v12.63,36.69 12.76,36.82 16.17,36.82 16.76,37.41 U1.54
SPI2_MISO  (via drill 0.35)
  Top 0.203: v15.86,25.72 15.59,25.44 15.59,18.28 16.34,17.53 U1.51
  Bottom 0.203: ST1.35 4.19,25.29 5.06,26.16 11.33,26.16 11.77,25.72 v15.86,25.72
SPI2_MOSI  (via drill 0.35)
  Top 0.203: U1.52 17.45,20.07 18.24,20.85 18.24,28.21 v18.43,28.39
  Bottom 0.203: ST1.34 4.19,28.05 4.84,28.7 18.12,28.7 v18.43,28.39
SPI2_SCK
  Bottom 0.203: ST1.36 4.19,22.94 4.87,23.61 16.05,23.61 16.76,22.9 U1.53
SWDCLK
  Top 0.203: U1.DC 13.82,40.39 13.18,41.03 13.18,46.32 13.78,46.92 13.78,62.08 12.82,63.04 12.82,68.22 10.74,70.29 JP2.4
SWDIO
  Top 0.203: U1.DD 14.68,37.85 15.37,38.54 15.37,69.42 14.5,70.29 JP2.5
TX1  (via drill 0.35)
  Top 0.203: U1.26 7.41,17.52 8.17,18.28 8.17,42.79 6.76,44.2 v6.19,44.2
  Bottom 0.203: v6.19,44.2 4.61,44.2 4.19,44.63 ST1.27
TX2  (via drill 0.35)
  Top 0.203: U1.10 5.48,33.89 5.48,38.57 v6.03,39.12 v6.04,39.12
  Bottom 0.203: v6.04,39.12 5.46,39.12 ST1.29
TX5  (via drill 0.35)
  Top 0.203: ST1.31 4.19,34.1 5.21,33.08 5.21,12.17 6.05,11.33 7.13,11.33 7.76,10.69 7.76,2 v7.97,1.8
  Bottom 0.203: v7.97,1.8 8.5,1.27 21.14,1.27 21.84,1.97 U1.33
TX6  (via drill 0.35)
  Top 0.203: v19.35,28.38 19.35,28.37 18.7,27.72 18.7,16.9 17.8,16 17.8,7.97 17.19,7.37 U1.48
  Bottom 0.203: ST1.33 4.19,29.89 4.88,29.21 18.94,29.21 19.35,28.8 v19.35,28.38
USB1_D_N  (via drill 0.35)
  Top 0.203: v16.22,52.16 16.51,52.45 16.51,67.31 17.88,68.68 17.88,70.85 18.55,71.51 21.09,71.51 21.77,70.84 JP1.3
  Bottom 0.203: U1.D- 15.88,51.82 v16.22,52.16
USB1_D_P  (via drill 0.35)
  Top 0.203: v16.87,49.71 16.87,65.73 17.53,66.4 19.41,66.4 20.2,67.2 20.2,69.59 19.51,70.29 JP1.2
  Bottom 0.203: U1.D+ 16.43,49.28 v16.87,49.71

### Text on the board
tNames: USB Host | Debug
bNames: ct-Bot v2 Teensy-MCU-Board / v0.8.5 12/2019 / T. Sandmann CC BY-SA 4.0